# Altium schematic sheet 10_Misc.SchDoc: Misc (part 1 of 2)
size A3; Organization: Lime Microsystems; Address1: Surrey Tech Centre; Address2: Guildford GU2 7YG; Address3: Surrey; Address4: United Kingdom; Revision: v2.4; SheetNumber: 10; SheetTotal: 10
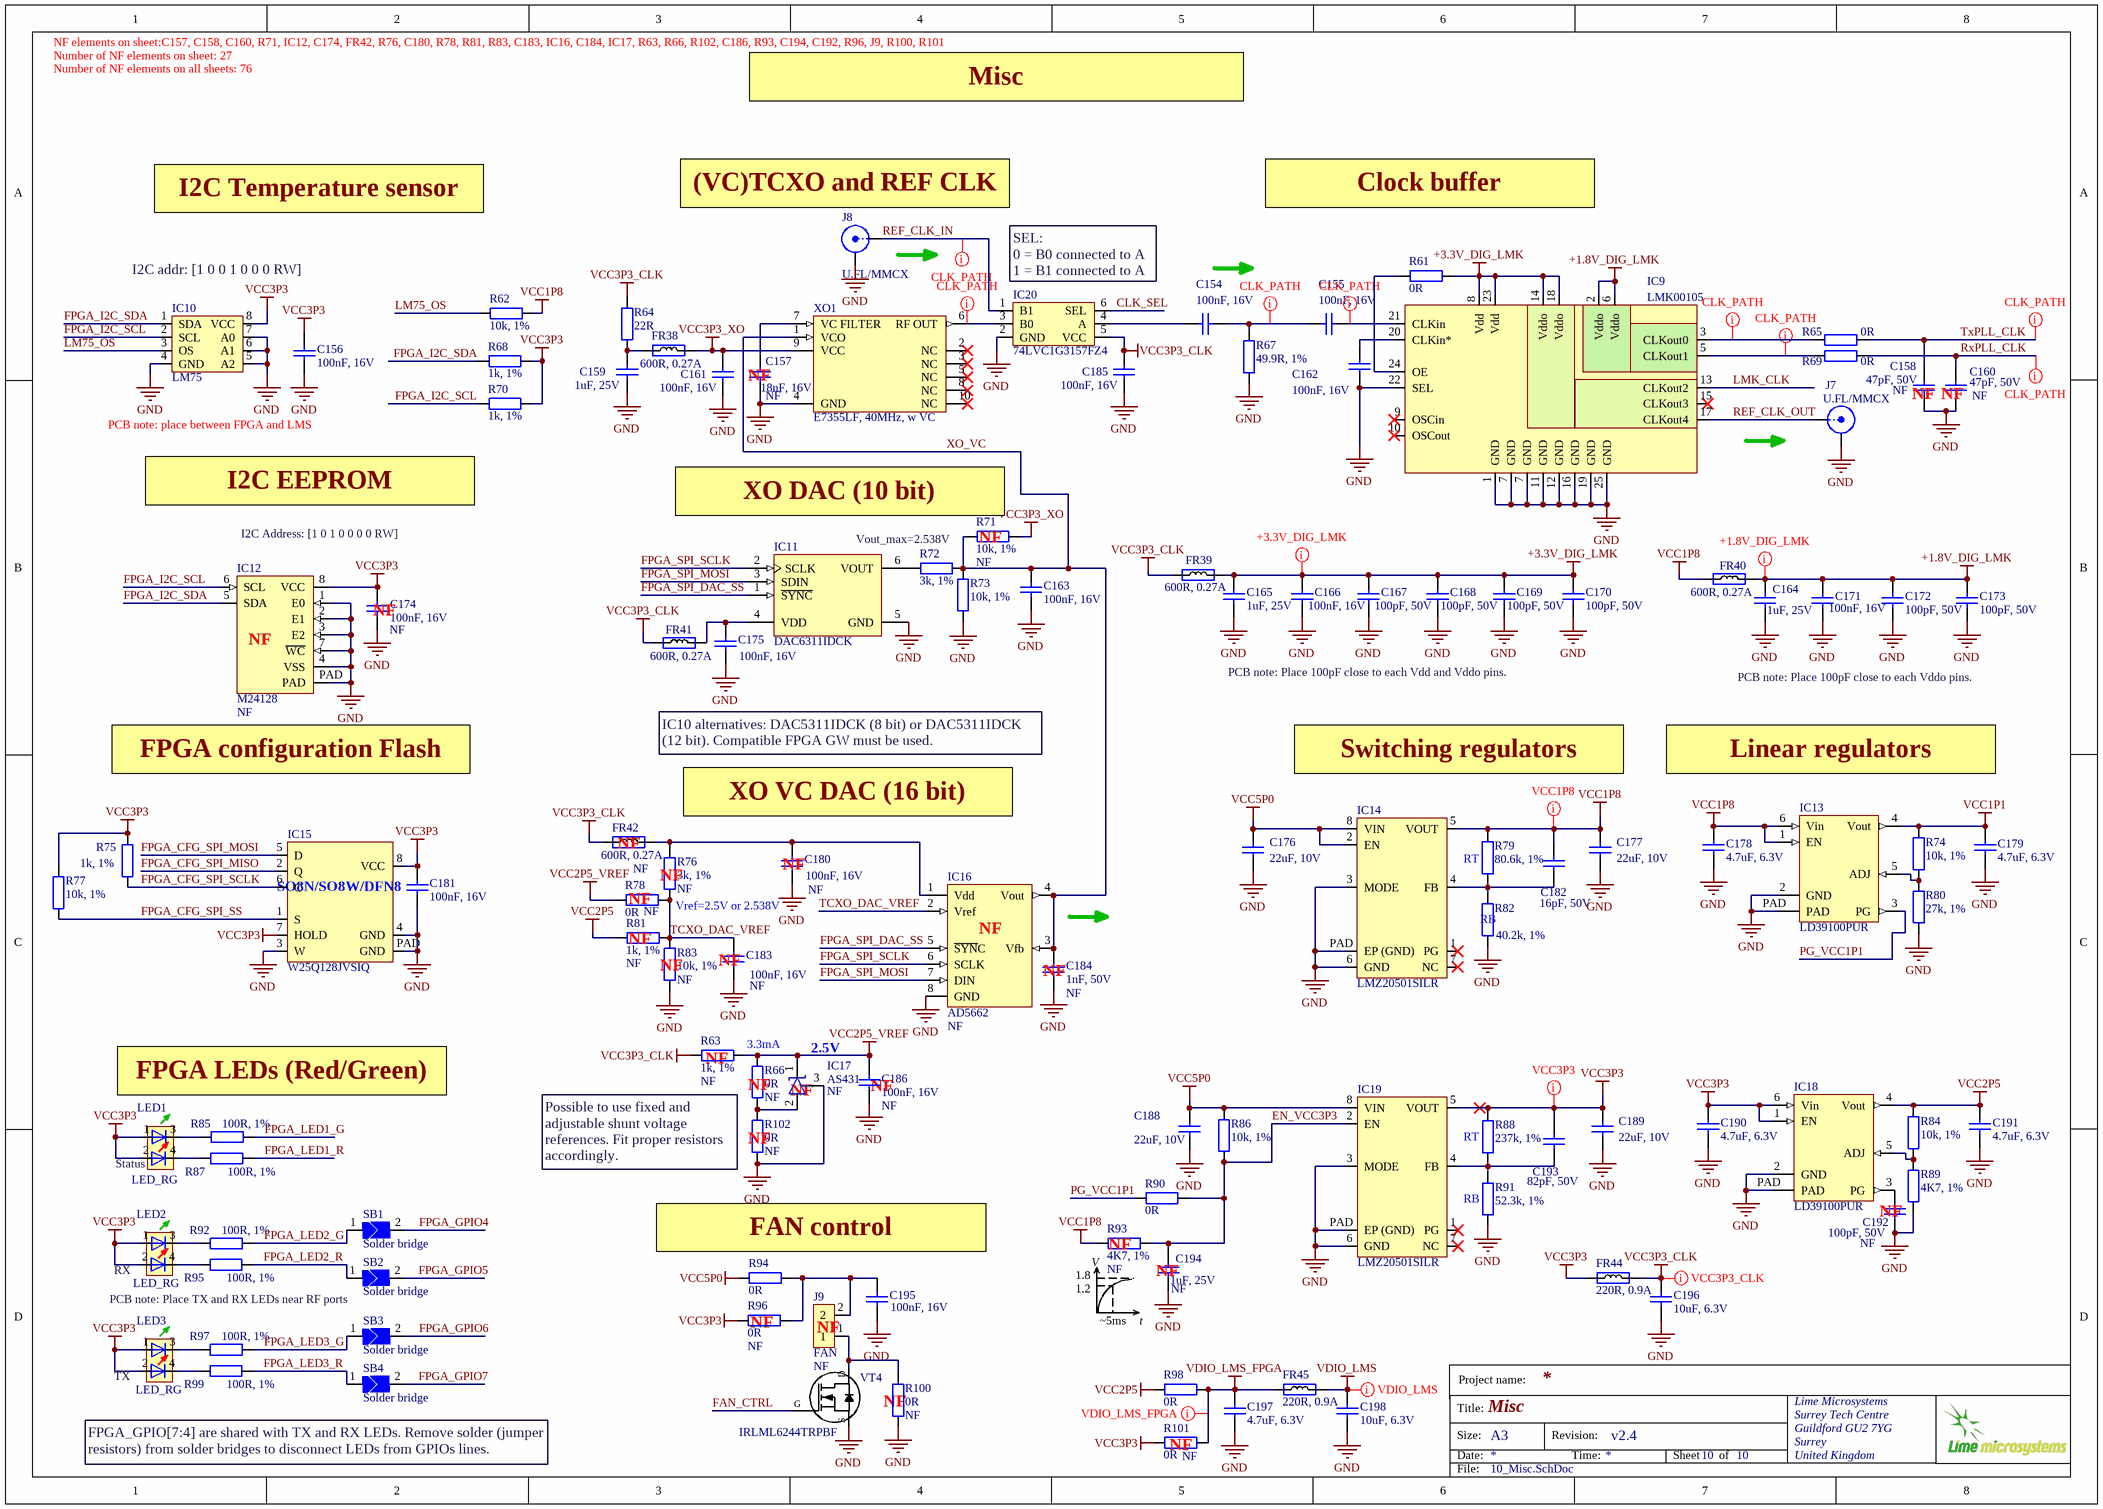
[diagram p0: 10_Misc.SchDoc]

## Parts
C154  100nF, 16V  [CAP0402]
C155  100nF, 16V  [CAP0402]
C156  100nF, 16V  [CAP0402]
C157  18nF, 16V  Assembly Info: NF  [CAP0402]
C158  47pF, 50V  Assembly Info: NF  [CAP0402]
C159  1uF, 25V  [CAP0402]
C160  47pF, 50V  Assembly Info: NF  [CAP0402]
C161  100nF, 16V  [CAP0402]
C162  100nF, 16V  [CAP0402]
C163  100nF, 16V  [CAP0402]
C164  1uF, 25V  [CAP0402]
C165  1uF, 25V  [CAP0402]
C166  100nF, 16V  [CAP0402]
C167  100pF, 50V  [CAP0402]
C168  100pF, 50V  [CAP0402]
C169  100pF, 50V  [CAP0402]
C170  100pF, 50V  [CAP0402]
C171  100nF, 16V  [CAP0402]
C172  100pF, 50V  [CAP0402]
C173  100pF, 50V  [CAP0402]
C174  100nF, 16V  Assembly Info: NF  [CAP0402]
C175  100nF, 16V  [CAP0402]
C176  22uF, 10V  [CAP0603]
C177  22uF, 10V  [CAP0603]
C178  4.7uF, 6.3V  [CAP0402]
C179  4.7uF, 6.3V  [CAP0402]
C180  100nF, 16V  Assembly Info: NF  [CAP0402]
C181  100nF, 16V  [CAP0402]
C182  16pF, 50V  [CAP0402]
C183  100nF, 16V  Assembly Info: NF  [CAP0402]
C184  1nF, 50V  Assembly Info: NF  [CAP0402]
C185  100nF, 16V  [CAP0402]
C186  100nF, 16V  Assembly Info: NF  [CAP0402]
C188  22uF, 10V  [CAP0603]
C189  22uF, 10V  [CAP0603]
C190  4.7uF, 6.3V  [CAP0402]
C191  4.7uF, 6.3V  [CAP0402]
C192  100pF, 50V  Assembly Info: NF  [CAP0402]
C193  82pF, 50V  [CAP0402]
C194  1uF, 25V  Assembly Info: NF  [CAP0402]
C195  100nF, 16V  [CAP0402]
C196  10uF, 6.3V  [CAP0603]
C197  4.7uF, 6.3V  [CAP0402]
C198  10uF, 6.3V  [CAP0603]
FR38  600R, 0.27A  [RES0201]
FR39  600R, 0.27A  [RES0201]
FR40  600R, 0.27A  [RES0201]
FR41  600R, 0.27A  [RES0201]
FR42  600R, 0.27A  Assembly Info: NF  [RES0201]
FR44  220R, 0.9A  [RES0402]
FR45  220R, 0.9A  [RES0402]
IC9  LMK00105  [LMK00105SQ]
IC10  LM75  [HWSON8_LM75]
IC11  DAC6311IDCK  [AD5601_SOT23-6]
IC12  M24128  Assembly Info: NF  [M24128-DFMC6TG]
IC13  LD39100PUR  [LD39100PUR]
IC14  LMZ20501SILR  [LMZ20501SILR_DC-DC_8-SMD]
IC15  W25Q128JVSIQ  [S25FL164K_WSON8_DFN6]
IC16  AD5662  Assembly Info: NF  [AD5662_SOT23-8]
IC17  AS431  Assembly Info: NF  [SOT23-3_V3]
IC18  LD39100PUR  [LD39100PUR]
IC19  LMZ20501SILR  [LMZ20501SILR_DC-DC_8-SMD]
IC20  74LVC1G3157FZ4  [74LVC1G3157FZ4_SPDT_SW_DFN1410-6]
J7  U.FL/MMCX  [MMCX_UFL_conn_u]
J8  U.FL/MMCX  [MMCX_UFL_conn_u]
J9  FAN  Assembly Info: NF  [Header2x1_TH_v2]
LED1  LED_RG  [LED-2x0603]
LED2  LED_RG  [LED-2x0603]
LED3  LED_RG  [LED-2x0603]
R61  0R  [RES0402]
R62  10k, 1%  [RES0402]
R63  1k, 1%  Assembly Info: NF  [RES0402]
R64  22R  [RES0402]
R65  0R  [RES0402]
R66  0R  Assembly Info: NF  [RES0402]
R67  49.9R, 1%  [RES0402]
R68  1k, 1%  [RES0402]
R69  0R  [RES0402]
R70  1k, 1%  [RES0402]
R71  10k, 1%  Assembly Info: NF  [RES0402]
R72  3k, 1%  [RES0402]
R73  10k, 1%  [RES0402]
R74  10k, 1%  [RES0402]
R75  1k, 1%  [RES0402]
R76  3k, 1%  Assembly Info: NF  [RES0402]
R77  10k, 1%  [RES0402]
R78  0R  Assembly Info: NF  [RES0402]
R79  80.6k, 1%  [RES0402]
R80  27k, 1%  [RES0402]
R81  1k, 1%  Assembly Info: NF  [RES0402]
R82  40.2k, 1%  [RES0402]
R83  10k, 1%  Assembly Info: NF  [RES0402]
R84  10k, 1%  [RES0402]
R85  100R, 1%  [RES0402]
R86  10k, 1%  [RES0402]
R87  100R, 1%  [RES0402]
R88  237k, 1%  [RES0402]
R89  4K7, 1%  [RES0402]
R90  0R  [RES0402]
R91  52.3k, 1%  [RES0402]
R92  100R, 1%  [RES0402]
R93  4K7, 1%  Assembly Info: NF  [RES0402]
R94  0R  [RES0402]
R95  100R, 1%  [RES0402]
R96  0R  Assembly Info: NF  [RES0402]
R97  100R, 1%  [RES0402]
R98  0R  [RES0402]
R99  100R, 1%  [RES0402]
R100  0R  Assembly Info: NF  [RES0402]
R101  0R  Assembly Info: NF  [RES0402]
R102  0R  Assembly Info: NF  [RES0402]
SB1  Solder bridge  [SOLDER_BRIDGE_TRIANGULAR_v2]
SB2  Solder bridge  [SOLDER_BRIDGE_TRIANGULAR_v2]
SB3  Solder bridge  [SOLDER_BRIDGE_TRIANGULAR_v2]
SB4  Solder bridge  [SOLDER_BRIDGE_TRIANGULAR_v2]
VT4  IRLML6244TRPBF  [SOT23-3]
XO1  E7355LF, 40MHz, w VC  [RAKON_RTX5032A]

## Nets
+1.8V_DIG_LMK: C164.2 C171.2 C172.2 C173.2 FR40.2 IC9.2(Vddo) IC9.6(Vddo)
+3.3V_DIG_LMK: C165.2 C166.2 C167.2 C168.2 C169.2 C170.2 FR39.2 IC9.8(Vdd) IC9.14(Vddo) IC9.18(Vddo) IC9.23(Vdd) R61.2
GND: C156.2 C157.1 C158.1 C159.1 C160.1 C161.1 C162.1 C163.1 C164.1 C165.1 C166.1 C167.1 C168.1 C169.1 C170.1 C171.1 C172.1 C173.1 C174.2 C175.2 C176.1 C177.1 C178.1 C179.1 C180.2 C181.2 C183.2 C184.2 C185.1 C186.1 C188.1 C189.1 C190.1 C191.1 C192.1 C194.1 C195.2 C196.1 C197.1 C198.1 IC9.1(GND) IC9.7(GND) IC9.11(GND) IC9.12(GND) IC9.16(GND) IC9.19(GND) IC9.22(SEL) IC9.25(GND) IC10.4(GND) IC10.5(A2) IC10.6(A1) IC10.7(A0) IC11.5(GND) IC12.1(E0) IC12.2(E1) IC12.3(E2) IC12.4(VSS) IC12.7(~{WC}) IC12.PAD IC13.2(GND) IC13.PAD IC14.3(MODE) IC14.6(GND) IC14.PAD(EP_(GND)) IC15.3(W) IC15.4(GND) IC15.PAD(GND) IC16.8(GND) IC17.3(NC/A) IC18.2(GND) IC18.PAD IC19.3(MODE) IC19.6(GND) IC19.PAD(EP_(GND)) IC20.2(GND) J7.2(Y) J8.2(Y) R67.1 R73.2 R80.2 R82.1 R83.2 R89.2 R91.1 R100.1 R102.2 VT4.S XO1.4(GND)
VCC1P1: C179.2 IC13.4(Vout) R74.2
VCC1P8: C177.2 C178.2 C182.1 FR40.1 IC13.1(EN) IC13.6(Vin) IC14.5(VOUT) R62.2 R79.2 R93.2
VCC2P5: C191.2 IC18.4(Vout) R81.2 R84.2 R98.1
VCC2P5_VREF: C186.2 IC17.1(K) R63.1 R66.1 R78.1
VCC3P3: C156.1 C174.1 C181.1 C189.2 C190.2 C193.1 FR44.1 IC10.8(VCC) IC12.8(VCC) IC15.7(HOLD) IC15.8(VCC) IC18.1(EN) IC18.6(Vin) IC19.5(VOUT) LED1.1 LED1.2 LED2.1 LED2.2 LED3.1 LED3.2 R68.1 R70.1 R75.2 R77.2 R88.2 R96.1 R101.1
VCC3P3_CLK: C185.2 C196.2 FR39.1 FR41.1 FR42.1 FR44.2 IC20.5(VCC) R63.2 R64.2
VCC3P3_XO: C161.2 FR38.2 R71.2 XO1.9(VCC)
VCC5P0: C176.2 C188.2 IC14.2(EN) IC14.8(VIN) IC19.8(VIN) R86.2 R94.1
VDIO_LMS: C198.2 FR45.2
VDIO_LMS_FPGA: C197.2 FR45.1 R98.2 R101.2
CLK_SEL: IC20.6(SEL)
EN_VCC3P3: C194.2 IC19.2(EN) R86.1 R90.2 R93.1
FAN_CTRL: VT4.G
FPGA_CFG_SPI_MISO: IC15.2(Q)
FPGA_CFG_SPI_MOSI: IC15.5(D)
FPGA_CFG_SPI_SCLK: IC15.6(C) R75.1
FPGA_CFG_SPI_SS: IC15.1(S) R77.1
FPGA_GPIO4: SB1.2
FPGA_GPIO5: SB2.2
FPGA_GPIO6: SB3.2
FPGA_GPIO7: SB4.2
FPGA_I2C_SCL: IC10.2(SCL) IC12.6(SCL) R70.2
FPGA_I2C_SDA: IC10.1(SDA) IC12.5(SDA) R68.2
FPGA_LED1_G: R85.2
FPGA_LED1_R: R87.2
FPGA_LED2_G: R92.2 SB1.1
FPGA_LED2_R: R95.2 SB2.1
FPGA_LED3_G: R97.2 SB3.1
FPGA_LED3_R: R99.2 SB4.1
FPGA_SPI_DAC_SS: IC11.1(~{SYNC}) IC16.5(~{SYN}C)
FPGA_SPI_MOSI: IC11.3(SDIN) IC16.7(DIN)
FPGA_SPI_SCLK: IC11.2(SCLK) IC16.6(SCLK)
LM75_OS: IC10.3(OS) R62.1
LMK_CLK: IC9.13(CLKout2)
PG_VCC1P1: IC13.3(PG) R90.1
REF_CLK_IN: IC20.1(B1) J8.1(X)
REF_CLK_OUT: IC9.17(CLKout4) J7.1(X)
RxPLL_CLK: C160.2 R69.1
TCXO_DAC_VREF: C183.1 IC16.2(Vref) R76.1 R78.2 R81.1 R83.1
TxPLL_CLK: C158.2 R65.1
XO_VC: C163.2 C184.1 IC16.3(Vfb) IC16.4(Vout) R71.1 R72.1 R73.1 XO1.1(VCO)
NetC154_1: C154.1 C155.2 R67.2
NetC154_2: C154.2 IC20.4(A)
NetC155_1: C155.1 IC9.21(CLKin)
NetC157_2: C157.2 XO1.7(VC_FILTER)
NetC159_2: C159.2 FR38.1 R64.1
NetC162_2: C162.2 IC9.20(CLKin*)
NetC175_1: C175.1 FR41.2 IC11.4(VDD)
NetC180_1: C180.1 FR42.2 IC16.1(Vdd) R76.2
NetC182_2: C182.2 IC14.4(FB) R79.1 R82.2
NetC192_2: C192.2 IC18.3(PG)
NetC193_2: C193.2 IC19.4(FB) R88.1 R91.2
NetC195_1: C195.1 J9.2 R94.2 R96.2
NetIC9_3: IC9.3(CLKout0) R65.2
NetIC9_5: IC9.5(CLKout1) R69.2
NetIC9_24: IC9.24(OE) R61.1
NetIC11_6: IC11.6(VOUT) R72.2
NetIC13_5: IC13.5(ADJ) R74.1 R80.1
NetIC17_2: IC17.2(A) R66.2 R102.1
NetIC18_5: IC18.5(ADJ) R84.1 R89.1
NetIC20_3: IC20.3(B0) XO1.6(RF_OUT)
NetJ9_1: J9.1 R100.2 VT4.D
NetLED1_3: LED1.3 R85.1
NetLED1_4: LED1.4 R87.1
NetLED2_3: LED2.3 R92.1
NetLED2_4: LED2.4 R95.1
NetLED3_3: LED3.3 R97.1
NetLED3_4: LED3.4 R99.1

Not connected (* = marked no-connect by the designer): IC9 9(OSCin)* 10(OSCout)* 15(CLKout3)*; IC14 1(PG)* 7(NC)*; IC19 1(PG)* 7(NC)*; XO1 2(NC)* 3(NC)* 5(NC)* 8(NC)* 10(NC)*

## Layout directives
net class CLK_PATH: NetC154_1, NetC155_1, NetIC9_3, NetIC9_5, NetIC20_3, REF_CLK_IN, RxPLL_CLK, TxPLL_CLK
net class +3.3V_DIG_LMK: +3.3V_DIG_LMK
net class +1.8V_DIG_LMK: +1.8V_DIG_LMK
net class VCC3P3_CLK: VCC3P3_CLK
net class VCC1P8: VCC1P8
net class VDIO_LMS: VDIO_LMS
net class VDIO_LMS_FPGA: VDIO_LMS_FPGA
net class VCC3P3: VCC3P3

## Notes on the sheet
- NF elements on sheet:C157, C158, C160, R71, IC12, C174, FR42, R76, C180, R78, R81, R83, C183, IC16, C184, IC17, R63, R66, R102, C186, R93, C194, C192, R96, J9, R100, R101
- Number of NF elements on sheet: 27
- Number of NF elements on all sheets: 76
- Misc
- I2C Temperature sensor
- (near J8) (VC)TCXO and REF CLK
- Clock buffer
- I2C addr: [1 0 0 1 0 0 0 RW]
- (near IC20) SEL:
  0 = B0 connected to A
  1 = B1 connected to A
- (near C157) NF
- PCB note: place between FPGA and LMS
- (near C158) NF
- (near C160) NF
- I2C EEPROM
- (near R71) XO DAC (10 bit)
- I2C Address: [1 0 1 0 0 0 0 RW]
- Vout_max=2.538V
- (near R71) NF
- (near IC12) NF
- (near C174) NF
- PCB note: Place 100pF close to each Vdd and Vddo pins.
- PCB note: Place 100pF close to each Vddo pins.
- (near IC12) FPGA configuration Flash
- IC10 alternatives: DAC5311IDCK (8 bit) or DAC5311IDCK (12 bit). Compatible FPGA GW must be used.
- Switching regulators
- Linear regulators
- (near FR42) NF
- XO VC DAC (16 bit)
- (near R78) NF
- (near R76) NF
- Vref=2.5V or 2.538V
- (near C180) NF
- RT
- (near R82) RB
- (near R81) NF
- (near R83) NF
- (near C183) NF
- (near IC16) NF
- NF
- 3.3mA
- 2.5V
- FPGA LEDs (Red/Green)
- (near R63) NF
- (near R66) NF
- (near IC17) NF
- (near C186) NF
- (near LED1) Status
- Possible to use fixed and adjustable shunt voltage references. Fit proper resistors accordingly.
- (near R102) NF
- FAN control
- (near R93) NF
- RB
- (near SB2) PCB note: Place TX and RX LEDs near RF ports
- (near LED2) RX
- (near R96) NF
- (near R93) 1.8
- (near R93) 1.2
- (near R93) V
- ~5ms
- t
- (near C194) NF
- (near LED3) TX
- (near J9) NF
- FPGA_GPIO[7:4] are shared with TX and RX LEDs. Remove solder (jumper resistors) from solder bridges to disconnect LEDs from GPIOs lines.
- (near R100) NF
- (near R101) NF
- Project name:
- Title:
- Size:
- Date:
- A3
- Revision:
- Time:
- Sheet
- of
- File:
- (in symbol M25P40_with_pad) SO8N/SO8W/DFN8